# Altium schematic sheet 100_UART_FLASH.SchDoc: TempeMaxComm
size A4; DocumentNumber: 1; Revision: 0.1; SheetNumber: 4; SheetTotal: 4
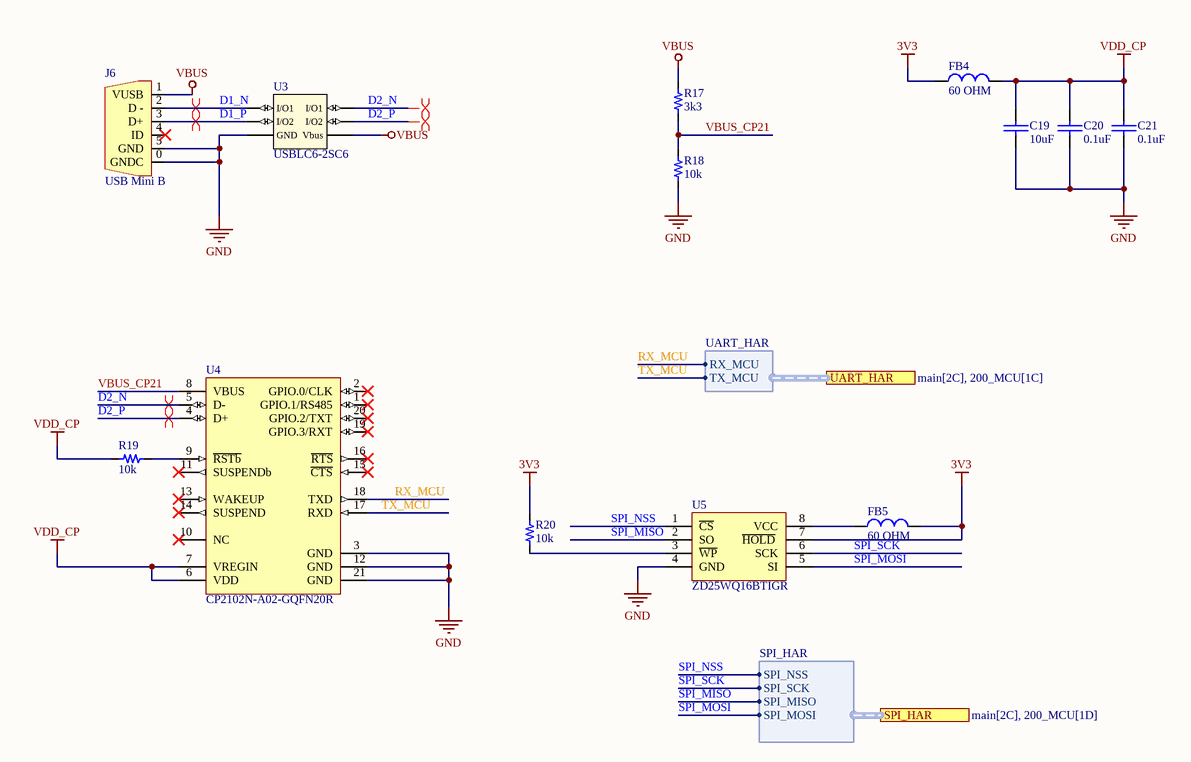
[diagram p0: 100_UART_FLASH.SchDoc]

## Parts
C19  value 10uF  [0603_cap]  (hidden comment: 10uF 10V)
C20  value 0.1uF  [0603_cap]  (hidden comment: 0.1uF 50V)
C21  value 0.1uF  [0603_cap]  (hidden comment: 0.1uF 50V)
FB4  value 60 OHM  [0603_fb]  (hidden comment: 60OHM 2A)
FB5  value 60 OHM  [0603_fb]  (hidden comment: 60OHM 2A)
J6  USB Mini B  [CON_5x1_SMD_miniUSB_B]
R17  value 3k3  [0603_res]  (hidden comment: 3k3 1/10W)
R18  value 10k  [0603_res]  (hidden comment: 10k 1/10W)
R19  value 10k  [0603_res]  (hidden comment: 10k 1/10W)
R20  value 10k  [0603_res]  (hidden comment: 10k 1/10W)
U3  USBLC6-2SC6  [SOT_23_6]
U4  CP2102N-A02-GQFN20R  [WFQFN_20_EP_3X3MM]
U5  ZD25WQ16BTIGR  [SOIC_8_3.9mm]

## Ports
SPI_HAR (harness SPI_HAR, see main[2C], 200_MCU[1D]), UART_HAR (harness UART_HAR, see main[2C], 200_MCU[1C])

## Harnesses
SPI_HAR: SPI_NSS, SPI_SCK, SPI_MISO, SPI_MOSI
UART_HAR: RX_MCU, TX_MCU

## Nets
3V3: FB4.1 FB5.2 R20.1 U5.7(~{HOLD})
GND: C19.2 C20.2 C21.2 J6.0(GNDC) J6.5(GND) R18.1 U3.2(GND) U4.3(GND) U4.12(GND) U4.21(GND) U5.4(GND)
VBUS: J6.1(VUSB) R17.2 U3.5(Vbus)
VDD_CP: C19.1 C20.1 C21.1 FB4.2 R19.2 U4.6(VDD) U4.7(VREGIN)
D1_N: J6.2(D_-) U3.1(I/O1)
D1_P: J6.3(D+) U3.3(I/O2)
D2_N: U3.6(I/O1) U4.5(D-)
D2_P: U3.4(I/O2) U4.4(D+)
RX_MCU: U4.18(TXD) ; port UART_HAR.RX_MCU
SPI_MISO: U5.2(SO) ; port SPI_HAR.SPI_MISO
SPI_MOSI: U5.5(SI) ; port SPI_HAR.SPI_MOSI
SPI_NSS: U5.1(~{CS}) ; port SPI_HAR.SPI_NSS
SPI_SCK: U5.6(SCK) ; port SPI_HAR.SPI_SCK
TX_MCU: U4.17(RXD) ; port UART_HAR.TX_MCU
VBUS_CP21: R17.1 R18.2 U4.8(VBUS)
NetFB5_1: FB5.1 U5.8(VCC)
NetR19_1: R19.1 U4.9(~{RSTb})
NetR20_2: R20.2 U5.3(~{WP})

Not connected (* = marked no-connect by the designer): J6 4(ID)*; U4 1(GPIO.1/RS485)* 2(GPIO.0/CLK)* 10(NC)* 11(SUSPENDb)* 13(WAKEUP)* 14(SUSPEND)* 15(~{CTS})* 16(~{RTS})* 19(GPIO.3/RXT)* 20(GPIO.2/TXT)*

## Layout directives
differential pair: D1_N, D1_P, D2_N, D2_P

## Notes on the sheet
- Title
- Size:
- Date:
- A4
- Number:
- Time:
- Revision:
- Sheet
- of
- File:

## Library data of the parts
C19 = Cap_10uF_0603_10V: 10V 10uF X5R ±10% 0603 Multilayer Ceramic Capacitors MLCC - SMD/SMT ROHS; Manufacturer: CCTC; Manufacturer Part Number: TCC0603X5R106K100CT; Supplier 1: LCSC; Supplier Part Number 1: C380314; ComponentLink1Description: LCSC; ComponentLink1URL: https://www.lcsc.com/product-detail/Multilayer-Ceramic-Capacitors-MLCC-SMD-SMT_CCTC-TCC0603X5R106K100CT_C380314.html
C20 C21 = Cap_0.1uF_0603_50V: 50V 100nF Y5V -20%~+80% 0603 Multilayer Ceramic Capacitors MLCC - SMD/SMT ROHS; Manufacturer: Walsin Tech Corp; Manufacturer Part Number: 0603F104Z500CT; Supplier 1: LCSC; Supplier Part Number 1: C83060; ComponentLink1Description: LCSC; ComponentLink1URL: https://www.lcsc.com/product-detail/Multilayer-Ceramic-Capacitors-MLCC-SMD-SMT_Walsin-Tech-Corp-0603F104Z500CT_C83060.html
FB4 FB5 = FB_60_0603_2A: 2A 1 100mΩ 60Ω@100MHz ±25% 0603 Ferrite Beads ROHS; Manufacturer: TAI-TECH; Manufacturer Part Number: HCB1608KF-600T20; ComponentLink1Description: LCSC; ComponentLink1URL: https://www.lcsc.com/product-detail/Ferrite-Beads_TAI-TECH-HCB1608KF-600T20_C369516.html; Supplier 1: LCSC; Supplier Part Number 1: C369516
J6 = Con_Mini_USB_B: CONN RCPT USB2.0 MINI B SMD R/A; Manufacturer Part Number: KH-MINI-SMT-5P-Cu; Manufacturer: EDAC Inc.; ComponentLink1Description: LCSC; ComponentLink1URL: https://datasheet.lcsc.com/lcsc/2106070035_Shenzhen-Kinghelm-Elec-KH-MINI-SMT-5P-Cu_C2688795.pdf; Supplier 1: LCSC; Supplier Part Number 1: C2688795
R17 = Res_3k3_0603_1/10W: RES SMD 3k3 OHM 5% 1/10W 0603; Manufacturer: FOJAN; Manufacturer Part Number: FRC0603J332 TS; ComponentLink1URL: https://www.lcsc.com/product-detail/Chip-Resistor-Surface-Mount_FOJAN-FRC0603J332-TS_C2907140.html; Supplier 1: LCSC; Supplier Part Number 1: C2907140; ComponentLink1Description: LCSC
R18-R20 = Res_10k_0603_1/10W: RES SMD 10k OHM 5% 1/10W 0603; Manufacturer: FOJAN; Manufacturer Part Number: FRC0603J103TS; ComponentLink1URL: https://www.lcsc.com/product-detail/Chip-Resistor-Surface-Mount_FOJAN-FRC0603J103TS_C2930027.html; Supplier 1: LCSC; Supplier Part Number 1: C2930027; ComponentLink1Description: LCSC
U3 = TVS_5.25V_2CH_SOT_23_6: TVS DIODE 5.25V 17V SOT23-6; Manufacturer: STMicroelectronics; ComponentLink1Description: LCSC; ComponentLink1URL: https://www.lcsc.com/product-detail/ESD-Protection-Devices_STMicroelectronics-USBLC6-2SC6_C7519.html; Supplier 1: LCSC; Manufacturer Part Number: USBLC6-2SC6; Supplier Part Number 1: C7519
U4 = IC_SGL_USB2UART-BRIDGE_20QFN: IC USB TO UART BRIDGE QFN20; Manufacturer: Silicon Labs; Manufacturer Part Number: CP2102N-A02-GQFN20R; Supplier 1: LCSC; Supplier Part Number 1: C969913; ComponentLink1Description: LCSC; ComponentLink1URL: https://www.lcsc.com/product-detail/USB-ICs_SILICON-LABS-CP2102N-A02-GQFN20R_C969913.html
U5 = IC_FLASH_ZD25WQ16BTIGR_8SOP: IC FLASH 16M SPI 85MHZ 8SOP; Manufacturer: Zetta; Manufacturer Part Number: ZD25WQ16BTIGR; Supplier 1: LCSC; Supplier Part Number 1: C2896790; ComponentLink1Description: LCSC; ComponentLink1URL: https://www.lcsc.com/product-detail/NOR-FLASH_Zetta-ZD25WQ16BTIGR_C2896790.html